# Altium schematic sheet interface.SchDoc
size A4
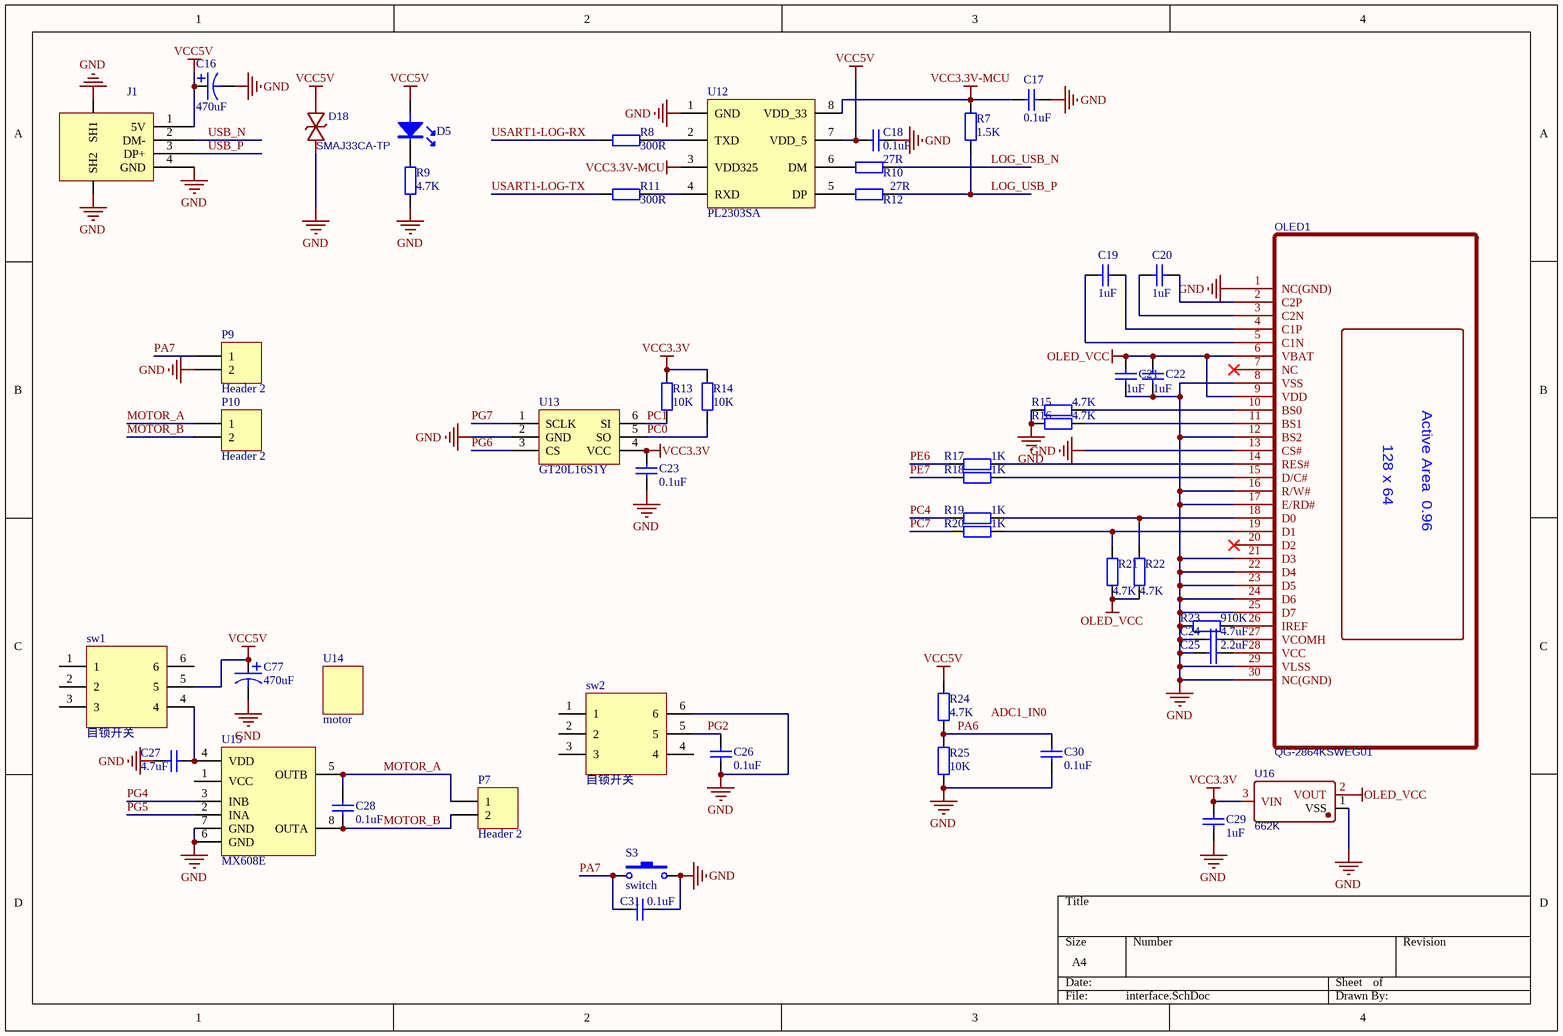
[diagram p0: interface.SchDoc]

## Parts
C16  470uF  [CAP-SMD_BD10.0-L10.3-W10.3-FD]
C17  0.1uF  [0603_C]
C18  0.1uF  [0603_C]
C19  1uF  [0603_C]
C20  1uF  [0603_C]
C21  1uF  [0603_C]
C22  1uF  [0603_C]
C23  0.1uF  [0603_C]
C24  4.7uF  [0603_C]
C25  2.2uF  [0603_C]
C26  0.1uF  [0603_C]
C27  4.7uF  [0603_C]
C28  0.1uF  [0603_C]
C29  1uF  [0603_C]
C30  0.1uF  [0603_C]
C31  0.1uF  [0603_C]
C77  470uF  [CAP-SMD_BD10.0-L10.3-W10.3-FD]
D5  LED  [0603_LED_S1]  (value not drawn)
D18  SMAJ33CA-TP  [SMA_L4.4-W2.6-LS5.0-BI]
J1  USB接口  [USB_D]  (value not drawn)
OLED1  QG-2864KSWEG01  [OLED-SMD_QG-2864KSWEG01-flod]
P7  Header 2  [HDR1X2]
P9  Header 2  [CONN-TH_WJ126V-5.0-2P]
P10  Header 2  [CONN-TH_WJ126V-5.0-2P]
R7  1.5K  [0603_R]
R8  300R  [0603_R]
R9  4.7K  [0603_R]
R10  27R  [0603_R]
R11  300R  [0603_R]
R12  27R  [0603_R]
R13  10K  [0603_R]
R14  10K  [0603_R]
R15  4.7K  [0603_R]
R16  4.7K  [0603_R]
R17  1K  [0603_R]
R18  1K  [0603_R]
R19  1K  [0603_R]
R20  1K  [0603_R]
R21  4.7K  [0603_R]
R22  4.7K  [0603_R]
R23  910K  [0603_R]
R24  4.7K  [0603_R]
R25  10K  [0603_R]
S3  switch  [SW-SMD_4P-L6.2-W6.2-P4.50-LS9.0]
sw1  自锁开关  [SW-TH_6P-L8.5-W8.5-P2.50-LS5.4-BL]
sw2  自锁开关  [SW-TH_6P-L8.5-W8.5-P2.50-LS5.4-BL]
U12  PL2303SA  [SOP-8_150mil]
U13  GT20L16S1Y  [SOT-23-6]
U14  motor  [MH-JS030LK140]
U15  MX608E  [SOP-8_150mil]
U16  662K  [SOT-23(SOT-23-3)]

## Nets
GND: C16.2 C17.1 C18.2 C21.2 C22.2 C23.1 C24.1 C25.1 C26.1 C27.1 C29.2 C30.1 C31.2 C77.2 D18.1 J1.4(GND) J1.SH1 J1.SH2 OLED1.1(NC(GND)) OLED1.8(VSS) OLED1.12(BS2) OLED1.13(CS#) OLED1.16(R/W#) OLED1.17(E/RD#) OLED1.21(D3) OLED1.22(D4) OLED1.23(D5) OLED1.24(D6) OLED1.25(D7) OLED1.29(VLSS) OLED1.30(NC(GND)) P9.2 R9.2 R15.1 R16.1 R23.2 R25.1 S3.2 sw2.6 U12.1(GND) U13.2(GND) U15.6(GND) U15.7(GND) U16.1(VSS)
OLED_VCC: C21.1 C22.1 OLED1.6(VBAT) OLED1.9(VDD) R21.1 R22.1 U16.2(VOUT)
VCC3.3V: C23.2 C29.1 R13.2 R14.2 U13.4(VCC) U16.3(VIN)
VCC3.3V-MCU: C17.2 R7.2 U12.3(VDD325) U12.8(VDD_33)
VCC5V: C16.1 C18.1 C77.1 D5.A D18.2 J1.1(5V) R24.2 sw1.5 U12.7(VDD_5)
LOG_USB_N: R10.2
LOG_USB_P: R7.1 R12.2
MOTOR_A: C28.1 P7.1 P10.1 U15.5(OUTB)
MOTOR_B: C28.2 P7.2 P10.2 U15.8(OUTA)
PA6: C30.2 R24.1 R25.2
PA7: C31.1 P9.1 S3.1
PC0: R14.1 U13.5(SO)
PC1: R13.1 U13.6(SI)
PC4: R19.1
PC7: R20.1
PE6: R17.1
PE7: R18.1
PG2: C26.2 sw2.5
PG4: U15.3(INB)
PG5: U15.2(INA)
PG6: U13.3(CS)
PG7: U13.1(SCLK)
USART1-LOG-RX: R8.1
USART1-LOG-TX: R11.1
USB_N: J1.2(DM-)
USB_P: J1.3(DP+)
NetC19_1: C19.1 OLED1.4(C1P)
NetC19_2: C19.2 OLED1.5(C1N)
NetC20_1: C20.1 OLED1.2(C2P)
NetC20_2: C20.2 OLED1.3(C2N)
NetC24_2: C24.2 OLED1.27(VCOMH)
NetC25_2: C25.2 OLED1.28(VCC)
NetC27_2: C27.2 sw1.4 U15.4(VDD)
NetD5_K: D5.K R9.1
NetOLED1_10: OLED1.10(BS0) R15.2
NetOLED1_11: OLED1.11(BS1) R16.2
NetOLED1_14: OLED1.14(RES#) R17.2
NetOLED1_15: OLED1.15(D/C#) R18.2
NetOLED1_18: OLED1.18(D0) R19.2 R22.2
NetOLED1_19: OLED1.19(D1) R20.2 R21.2
NetOLED1_26: OLED1.26(IREF) R23.1
NetR8_2: R8.2 U12.2(TXD)
NetR10_1: R10.1 U12.6(DM)
NetR11_2: R11.2 U12.4(RXD)
NetR12_1: R12.1 U12.5(DP)

Not connected (* = marked no-connect by the designer): OLED1 7(NC)* 20(D2)*; sw1 1 2 3 6; sw2 1 2 3 4; U15 1(VCC)

## Notes on the sheet
- Labels drawn without touching a wire or pin: ADC1_IN0
- (in symbol QG-2864KSWEG01) Active Area  0.96; 128 x 64

## Library data of the parts
C16 C77 = CAPACITOR: 贴片电容，1206
C17-C31 = Cap: 贴片电容，0603
D5 = LED: 贴片LED，0603，白色
D18 = SMAJ33CA-TP: TVS
J1 = USB: USB-B10-BRW
OLED1 = QG-2864KSWEG01: 128x64 单色白色，QG-2864KSWEG01; BOM_Manufacturer: Allvision; BOM_Supplier: LCSC; BOM_Manufacturer Part: QG-2864KSWEG01; BOM_Supplier Part: C85007; spicePre: O; spiceSymbolName: QG-2864KSWEG01
P7 = Header 2: 不焊; LatestRevisionDate: 17-Jul-2002; LatestRevisionNote: Re-released for DXP Platform.; Publisher: Altium Limited
P9 P10 = Header 2: WJ126V-5.0-2P，不焊
R7-R25 = Res2: 贴片电阻，0603
S3 = switch: 贴片按键，6*6*5
sw1 sw2 = switch_lock: 8.5*8.5*H22.35自锁按键开关
U12 = PL2303SA: USB转TTL芯片，PL2303SA，SOP-8_150mil
U13 = GT20L16S1Y: 字库芯片， SOT-23-6
U14 = motor: 顶呱呱工厂 MH-JS030LK140
U15 = MX608E: MX608E电机驱动，SOP8
U16 = 662K: 线性稳压器662k,SOT23-3